# EAGLE schematic QuadFCv1 (EAGLE 6.5.0)

## Sheet 1 of 7: MCU
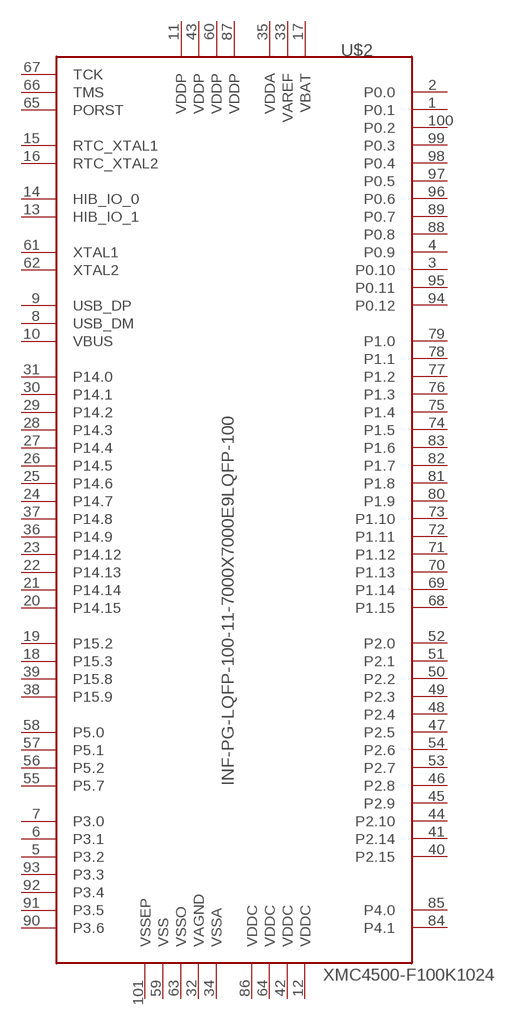
[diagram p0: schematic, sheet 1]

### Parts
U$2  INF-PG-LQFP-100-11-7000X7000E9LQFP-100  [INF-PG-LQFP-100-11-7000X7000E9PRIMARY]
Unconnected: U$2.1(P0.1) U$2.2(P0.0) U$2.3(P0.10) U$2.4(P0.9) U$2.5(P3.2) U$2.6(P3.1) U$2.7(P3.0) U$2.8(USB_DM) U$2.9(USB_DP) U$2.10(VBUS) U$2.11(VDDP) U$2.12(VDDC) U$2.13(HIB_IO_1) U$2.14(HIB_IO_0) U$2.15(RTC_XTAL1) U$2.16(RTC_XTAL2) U$2.17(VBAT) U$2.18(P15.3) U$2.19(P15.2) U$2.20(P14.15) U$2.21(P14.14) U$2.22(P14.13) U$2.23(P14.12) U$2.24(P14.7) U$2.25(P14.6) U$2.26(P14.5) U$2.27(P14.4) U$2.28(P14.3) U$2.29(P14.2) U$2.30(P14.1) U$2.31(P14.0) U$2.32(VAGND) U$2.33(VAREF) U$2.34(VSSA) U$2.35(VDDA) U$2.36(P14.9) U$2.37(P14.8) U$2.38(P15.9) U$2.39(P15.8) U$2.40(P2.15) U$2.41(P2.14) U$2.42(VDDC) U$2.43(VDDP) U$2.44(P2.10) U$2.45(P2.9) U$2.46(P2.8) U$2.47(P2.5) U$2.48(P2.4) U$2.49(P2.3) U$2.50(P2.2) U$2.51(P2.1) U$2.52(P2.0) U$2.53(P2.7) U$2.54(P2.6) U$2.55(P5.7) U$2.56(P5.2) U$2.57(P5.1) U$2.58(P5.0) U$2.59(VSS) U$2.60(VDDP) U$2.61(XTAL1) U$2.62(XTAL2) U$2.63(VSSO) U$2.64(VDDC) U$2.65(PORST) U$2.66(TMS) U$2.67(TCK) U$2.68(P1.15) U$2.69(P1.14) U$2.70(P1.13) U$2.71(P1.12) U$2.72(P1.11) U$2.73(P1.10) U$2.74(P1.5) U$2.75(P1.4) U$2.76(P1.3) U$2.77(P1.2) U$2.78(P1.1) U$2.79(P1.0) U$2.80(P1.9) U$2.81(P1.8) U$2.82(P1.7) U$2.83(P1.6) U$2.84(P4.1) U$2.85(P4.0) U$2.86(VDDC) U$2.87(VDDP) U$2.88(P0.8) U$2.89(P0.7) U$2.90(P3.6) U$2.91(P3.5) U$2.92(P3.4) U$2.93(P3.3) U$2.94(P0.12) U$2.95(P0.11) U$2.96(P0.6) U$2.97(P0.5) U$2.98(P0.4) U$2.99(P0.3) U$2.100(P0.2) U$2.101(VSSEP)

## Sheet 2 of 7: Power Regulators, isolation, and jumper options

## Sheet 3 of 7: Interface All major connectors and edge pieces go here
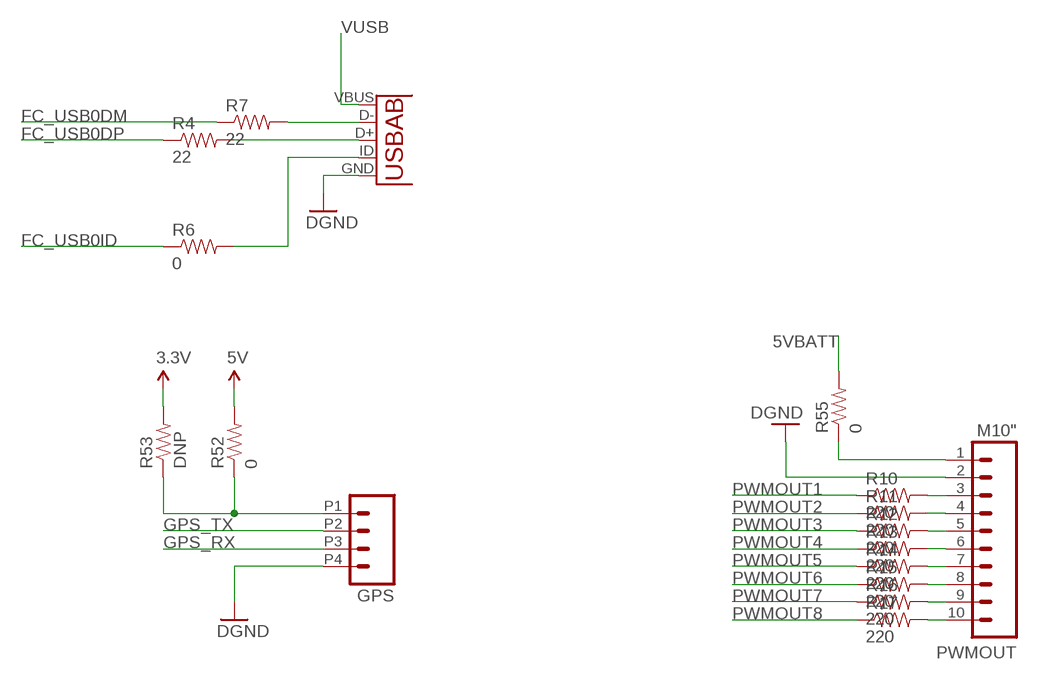
[diagram p1: schematic, sheet 3]

### Parts
GPS  M04DF13  [DF13A-4P-1.25H]
PWMOUT  M10"  [1X10]
R4  22  RESISTOR0402-RES  [0402-RES]
R6  0  RESISTOR0402-RES  [0402-RES]
R7  22  RESISTOR0402-RES  [0402-RES]
R10  220  RESISTOR0402-RES  [0402-RES]
R11  220  RESISTOR0402-RES  [0402-RES]
R12  220  RESISTOR0402-RES  [0402-RES]
R13  220  RESISTOR0402-RES  [0402-RES]
R14  220  RESISTOR0402-RES  [0402-RES]
R15  220  RESISTOR0402-RES  [0402-RES]
R16  220  RESISTOR0402-RES  [0402-RES]
R17  220  RESISTOR0402-RES  [0402-RES]
R52  0  RESISTOR0402-RES  [0402-RES]
R53  DNP  RESISTOR0402-RES  [0402-RES]
R55  0  RESISTOR0603-RES  [0603-RES]
U12  USB-AB  [USB-AB-MICRO-SMD]

### Nets
3.3V: R53.2 ; also sheet 6,7
5V: R52.2 ; also sheet 7
5VBATT: R55.2
FC_USB0DM: R7.1
FC_USB0DP: R4.1
FC_USB0ID: R6.1
GND: GPS.P4 PWMOUT.2 U12.GND ; supply symbol labelled DGND ; also sheet 6,7
GPS_RX: GPS.P3 ; also sheet 7
GPS_TX: GPS.P2 ; also sheet 7
N$9: PWMOUT.3 R10.2
N$10: PWMOUT.4 R11.2
N$11: PWMOUT.5 R12.2
N$12: PWMOUT.6 R13.2
N$13: PWMOUT.7 R14.2
N$14: PWMOUT.8 R15.2
N$15: PWMOUT.9 R16.2
N$16: PWMOUT.10 R17.2
N$26: PWMOUT.1 R55.1
N$27: R6.2 U12.ID(USBID)
N$29: R4.2 U12.D+
N$39: GPS.P1 R52.1 R53.1
N$49: R7.2 U12.D-
PWMOUT1: R10.1
PWMOUT2: R11.1
PWMOUT3: R12.1
PWMOUT4: R13.1
PWMOUT5: R14.1
PWMOUT6: R15.1
PWMOUT7: R16.1
PWMOUT8: R17.1
VUSB: U12.VBUS

## Sheet 4 of 7: Mechanical
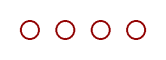
[diagram p2: schematic, sheet 4]

### Parts
STANDOFF1  STAND-OFF  [STAND-OFF]
STANDOFF2  STAND-OFF  [STAND-OFF]
STANDOFF3  STAND-OFF  [STAND-OFF]
STANDOFF4  STAND-OFF  [STAND-OFF]

## Sheet 5 of 7: IMU

## Sheet 6 of 7: Memory
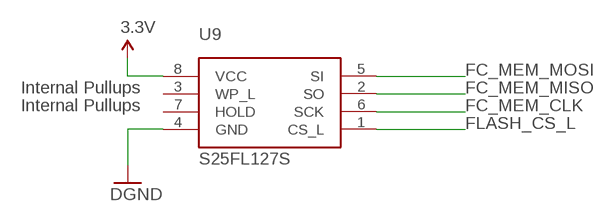
[diagram p3: schematic, sheet 6]

### Parts
U9  S25FL127S  [SOIC8]

### Nets
3.3V: U9.8(VCC) ; also sheet 3,7
FC_MEM_CLK: U9.6(SCK) ; also sheet 7
FC_MEM_MISO: U9.2(SO) ; also sheet 7
FC_MEM_MOSI: U9.5(SI) ; also sheet 7
FLASH_CS_L: U9.1(CS_L)
GND: U9.4(GND) ; supply symbol labelled DGND ; also sheet 3,7
Unconnected: U9.3(WP_L) U9.7(HOLD)

### Notes on the sheet
- Internal Pullups
- Internal Pullups

## Sheet 7 of 7: Shield Header
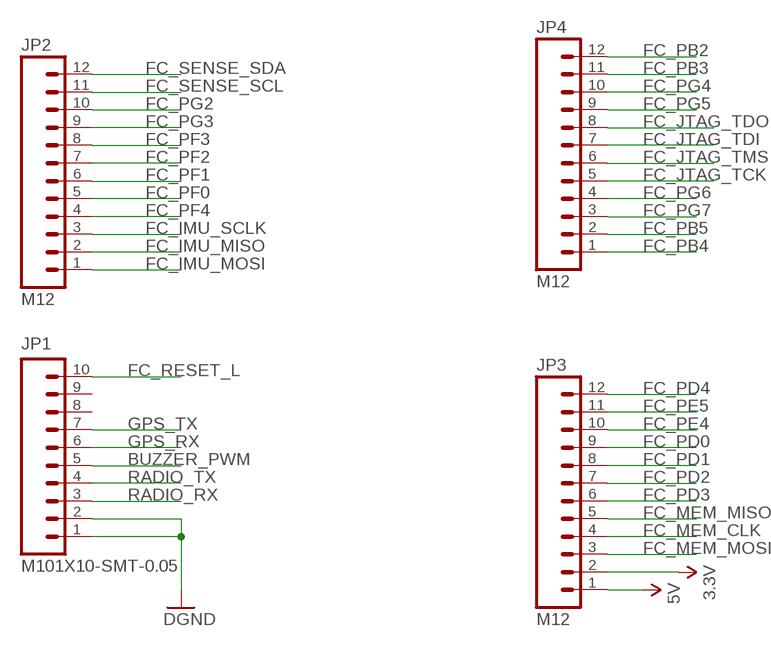
[diagram p4: schematic, sheet 7]

### Parts
JP1  M101X10-SMT-0.05  [1X10_SMT-0.05]
JP2  M12  [1X12_SMT-0.05]
JP3  M12  [1X12_SMT-0.05]
JP4  M12  [1X12_SMT-0.05]
U$1  INF-PG-LQFP-100-11-7000X7000E9  [INF-PG-LQFP-100-11-7000X7000E9PRIMARY]  (not placed on a sheet)

### Nets
3.3V: JP3.2 ; also sheet 3,6
5V: JP3.1 ; also sheet 3
BUZZER_PWM: JP1.5
FC_IMU_MISO: JP2.2
FC_IMU_MOSI: JP2.1
FC_IMU_SCLK: JP2.3
FC_JTAG_TCK: JP4.5
FC_JTAG_TDI: JP4.7
FC_JTAG_TDO: JP4.8
FC_JTAG_TMS: JP4.6
FC_MEM_CLK: JP3.4 ; also sheet 6
FC_MEM_MISO: JP3.5 ; also sheet 6
FC_MEM_MOSI: JP3.3 ; also sheet 6
FC_PB2: JP4.12
FC_PB3: JP4.11
FC_PB4: JP4.1
FC_PB5: JP4.2
FC_PD0: JP3.9
FC_PD1: JP3.8
FC_PD2: JP3.7
FC_PD3: JP3.6
FC_PD4: JP3.12
FC_PE4: JP3.10
FC_PE5: JP3.11
FC_PF0: JP2.5
FC_PF1: JP2.6
FC_PF2: JP2.7
FC_PF3: JP2.8
FC_PF4: JP2.4
FC_PG2: JP2.10
FC_PG3: JP2.9
FC_PG4: JP4.10
FC_PG5: JP4.9
FC_PG6: JP4.4
FC_PG7: JP4.3
FC_RESET_L: JP1.10
FC_SENSE_SCL: JP2.11
FC_SENSE_SDA: JP2.12
GND: JP1.1 JP1.2 ; supply symbol labelled DGND ; also sheet 3,6
GPS_RX: JP1.6 ; also sheet 3
GPS_TX: JP1.7 ; also sheet 3
RADIO_RX: JP1.3
RADIO_TX: JP1.4
Unconnected: JP1.8 JP1.9

## Library data of the parts
GPS = QuadFCv1:M04: Header 4 Standard 4-pin 0.1" header. Use with straight break away headers (SKU : PRT-00116), right angle break away headers (PRT-00553), swiss pins (PRT-00743), machine pins (PRT-00117), and female headers (PRT-00115). Molex polarized connector foot print use with SKU : PRT-08231 with associated crimp pins and housings. 1MM SMD Version SKU: PRT-10208
JP1 PWMOUT = QuadFCv1:M10: Header 10 Standard 10-pin 0.1" header. Use with straight break away headers (SKU : PRT-00116), right angle break away headers (PRT-00553), swiss pins (PRT-00743), machine pins (PRT-00117), and female headers (PRT-00115).
JP2-JP4 = QuadFCv1:M12: Header 12 Standard 12-pin 0.1" header. Use with straight break away headers (SKU : PRT-00116), right angle break away headers (PRT-00553), swiss pins (PRT-00743), machine pins (PRT-00117), and female headers (PRT-00115).
R4 R6 R7 R10-R17 R52 R53 R55 = QuadFCv1:RESISTOR: Resistor Basic schematic elements and footprints for 0603, 1206, and PTH resistors.
STANDOFF1-STANDOFF4 = QuadFCv1:STAND-OFF: #4 Stand Off This is the mechanical footprint for a #4 phillips button head screw. Use the keepout ring to avoid running the screw head into surrounding components. SKU : PRT-00447
U9 = QuadFCv1:S25FL127S
U12 = QuadFCv1:USB-AB: This is a USB AB connector that is compatible with USB OTG. i.e. this connector can serve as a host or device
U$1 = INF-PG-LQFP-100-11-7000X7000TP_N:INF-PG-LQFP-100-11-7000X7000E9
U$2 = XMC4500-F100K1024 AB:INF-PG-LQFP-100-11-7000X7000E9

## Net classes
0 default: width 0.152 mm, clearance 0.152 mm